# EAGLE schematic xmas (EAGLE 8.3.2)
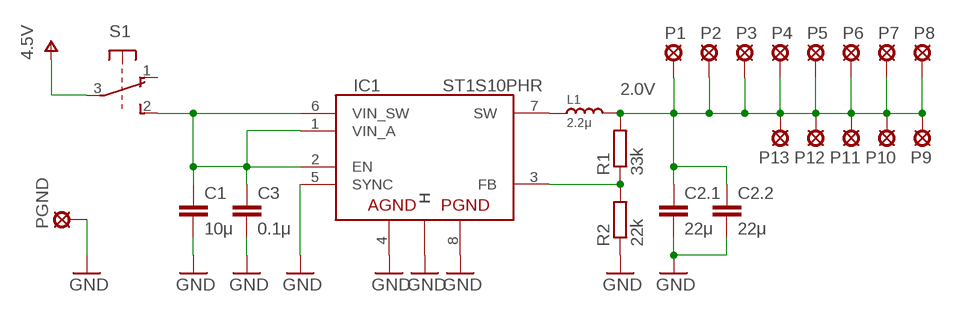
[diagram p0: schematic, sheet 1]

## Parts
C1  10μ  C-EUC1206  [C1206]
C2.1  22μ  C-EUC1206  [C1206]
C2.2  22μ  C-EUC1206  [C1206]
C3  0.1μ  C-EUC1206  [C1206]
IC1  ST1S10PHR  [HSOP8]
L1  2.2μ  LQH32C  [L1210W]
P1  LSP08  [LSP08]
P2  LSP08  [LSP08]
P3  LSP08  [LSP08]
P4  LSP08  [LSP08]
P5  LSP08  [LSP08]
P6  LSP08  [LSP08]
P7  LSP08  [LSP08]
P8  LSP08  [LSP08]
P9  LSP08  [LSP08]
P10  LSP08  [LSP08]
P11  LSP08  [LSP08]
P12  LSP08  [LSP08]
P13  LSP08  [LSP08]
PGND  LSP08  [LSP08]
R1  33k  R-EU_R1206  [R1206]
R2  22k  R-EU_R1206  [R1206]
S1  9077-2  [9077-2]

## Nets
2.0V: C2.1.1 C2.2.1 L1.2 P1.P$1(MP) P2.P$1(MP) P3.P$1(MP) P4.P$1(MP) P5.P$1(MP) P6.P$1(MP) P7.P$1(MP) P8.P$1(MP) P9.P$1(MP) P10.P$1(MP) P11.P$1(MP) P12.P$1(MP) P13.P$1(MP) R1.2
GND: C1.2 C2.1.2 C2.2.2 C3.2 IC1.4(AGND) IC1.5(SYNC) IC1.8(PGND) IC1.H@1(H) PGND.P$1(MP) R2.1
N$2: IC1.7(SW) L1.1
N$3: IC1.3(FB) R1.1 R2.2
V+: S1.3(1:P) ; supply symbol labelled 4.5V
V_IN: C1.1 C3.1 IC1.1(VIN_A) IC1.2(EN) IC1.6(VIN_SW) S1.2(1:S)
Unconnected: IC1.H@2(H) IC1.H@3(H) IC1.H@4(H) IC1.H@5(H) IC1.H@6(H) S1.1(1:O) S1.4(2:P) S1.5(2:S) S1.6(2:O)

## Library data of the parts
C1 C2.1 C2.2 C3 = resistor:C-EU: CAPACITOR, European symbol
IC1 = vreg-pulse:ST1S10: 3 A, 900 kHz, monolithic synchronous step-down regulator
L1 = murata:LQH32C: MURATA LQH32C Inductor Series
P1-P13 PGND = Gumix:LSP08
R1 R2 = resistor:R-EU_: RESISTOR, European symbol
S1 = Gumix:9077-2: MARQUARDT SWITCH 9077.0200 Distributor: Buerklin <https://www.buerklin.com/default.asp?event=ShowArtikel%2812G2822%29&l=d&jump=ArtNr_12G2822>